# EAGLE design PicoCradle (EAGLE 9.6.2)
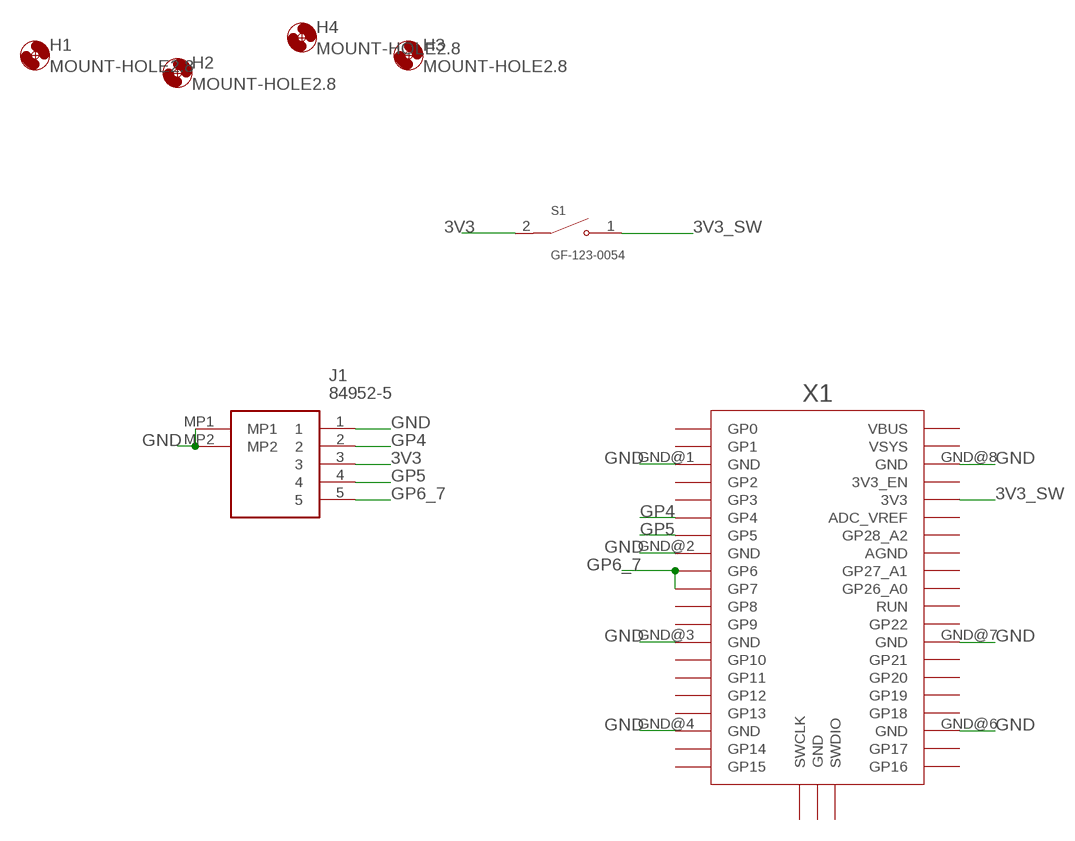
[diagram p0: schematic, sheet 1]

## Parts
H1  MOUNT-HOLE2.8  [2,8]
H2  MOUNT-HOLE2.8  [2,8]
H3  MOUNT-HOLE2.8  [2,8]
H4  MOUNT-HOLE2.8  [2,8]
J1  84952-5  [849525]
S1  GF-123-0054  [SW_GF-123-0054]
X1  RPI_PICO_IG-SMD  [RPI_PICO]

## Nets
3V3: J1.3 S1.2
3V3_SW: S1.1 X1.3V3
GND: J1.1 J1.MP1 J1.MP2 X1.GND@1(GND) X1.GND@2(GND) X1.GND@3(GND) X1.GND@4(GND) X1.GND@6(GND) X1.GND@7(GND) X1.GND@8(GND)
GP4: J1.2 X1.GP4
GP5: J1.4 X1.GP5
GP6_7: J1.5 X1.GP6 X1.GP7
Unconnected: X1.3V3_EN X1.ADC_VREF X1.AGND X1.GND@5(GND) X1.GP0 X1.GP1 X1.GP2 X1.GP3 X1.GP8 X1.GP9 X1.GP10 X1.GP11 X1.GP12 X1.GP13 X1.GP14 X1.GP15 X1.GP16 X1.GP17 X1.GP18 X1.GP19 X1.GP20 X1.GP21 X1.GP22 X1.GP26_A0 X1.GP27_A1 X1.GP28_A2 X1.RUN X1.SWCLK X1.SWDIO X1.VBUS X1.VSYS

## Library data of the parts
H1-H4 = holes:MOUNT-HOLE: MOUNTING HOLE with drill center marker
J1 = 84952-5:84952-5: 1MM FPC HORZ.BTTM CONT.ASS.5P Source: Datasheet <https://www.te.com/commerce/DocumentDelivery/DDEController?Action=srchrtrv&DocNm=84952&DocType=Customer Drawing&DocLang=English>; DESCRIPTION: 1MM FPC HORZ.BTTM CONT.ASS.5P; HEIGHT: 2.74mm; MANUFACTURER_NAME: TE Connectivity; MANUFACTURER_PART_NUMBER: 84952-5
S1 = GF-123-0054:GF-123-0054: Slide Switch SPST Through Hole Check availability <https://pricing.snapeda.com/parts/GF-123-0054/CW%20Industries/view-part?ref=eda>; AVAILABILITY: In Stock; DESCRIPTION: Slide Switch SPST Through Hole; MF: CW Industries; MP: GF-123-0054; PACKAGE: None; PRICE: None; PURCHASE-URL: https://pricing.snapeda.com/search/part/GF-123-0054/?ref=eda
X1 = RaspberryPi_Pico:RPI_PICO_IG

## Board
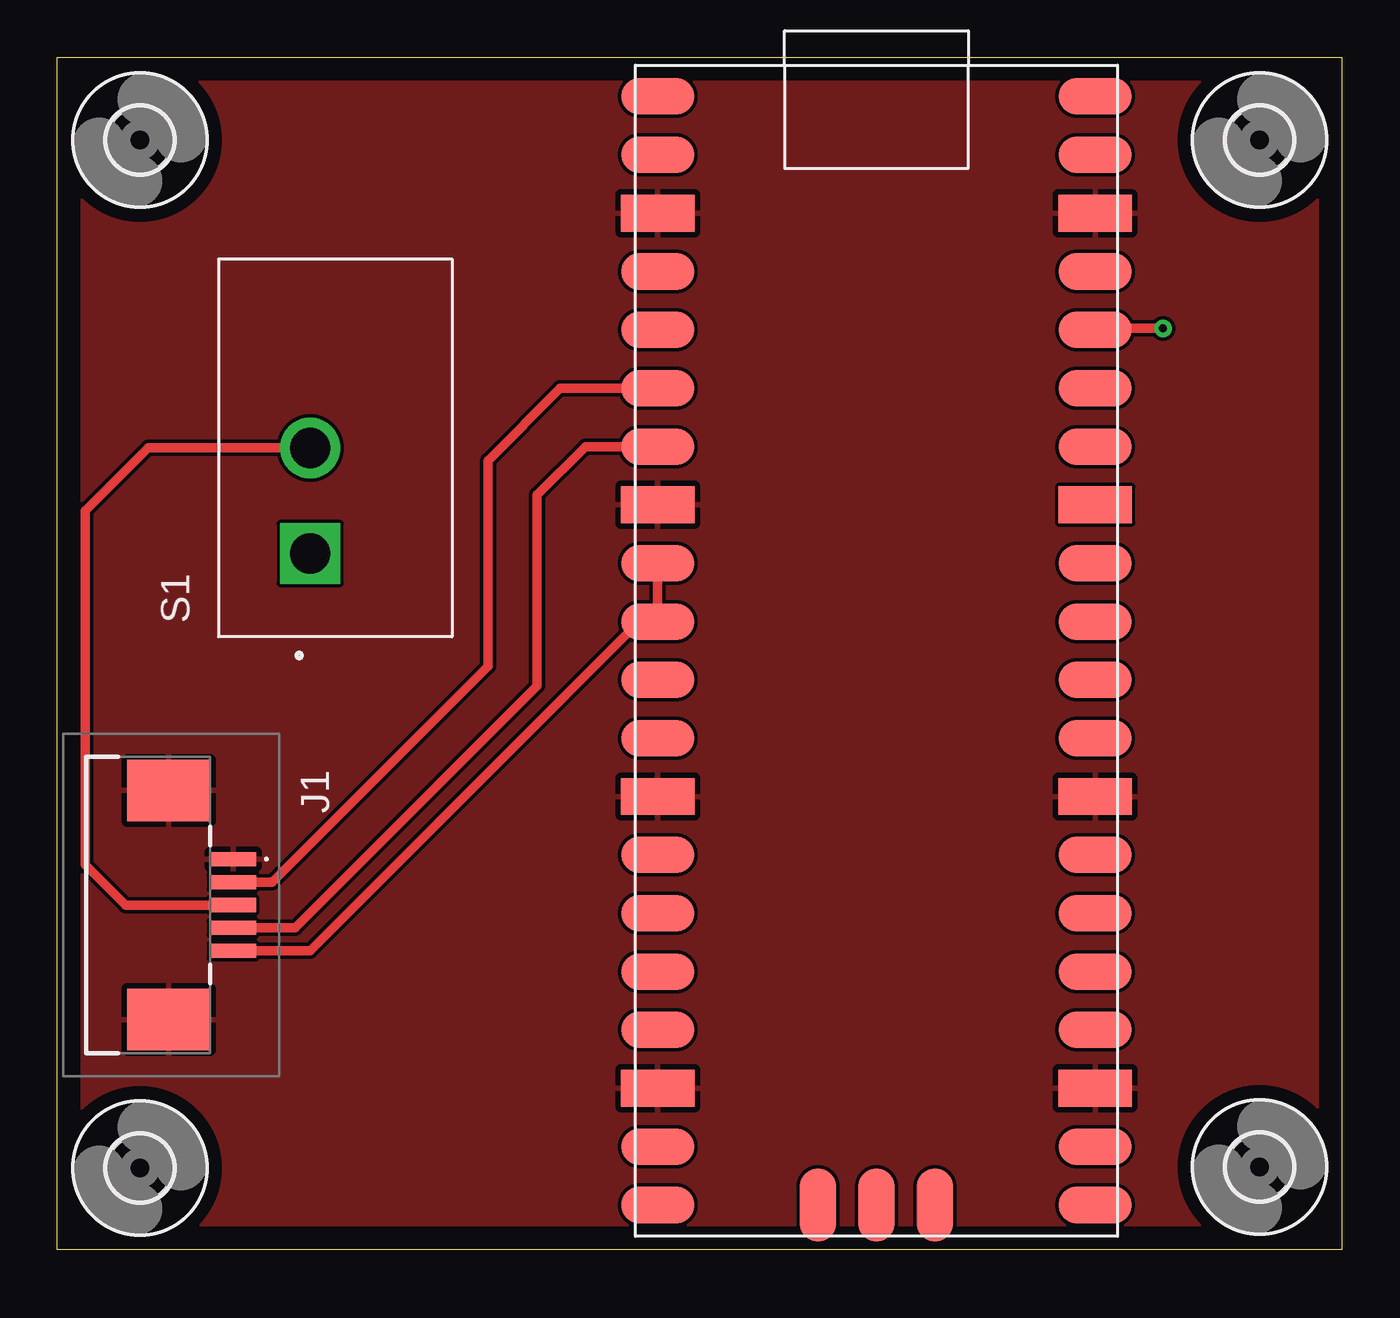
[diagram p1: board, top side]
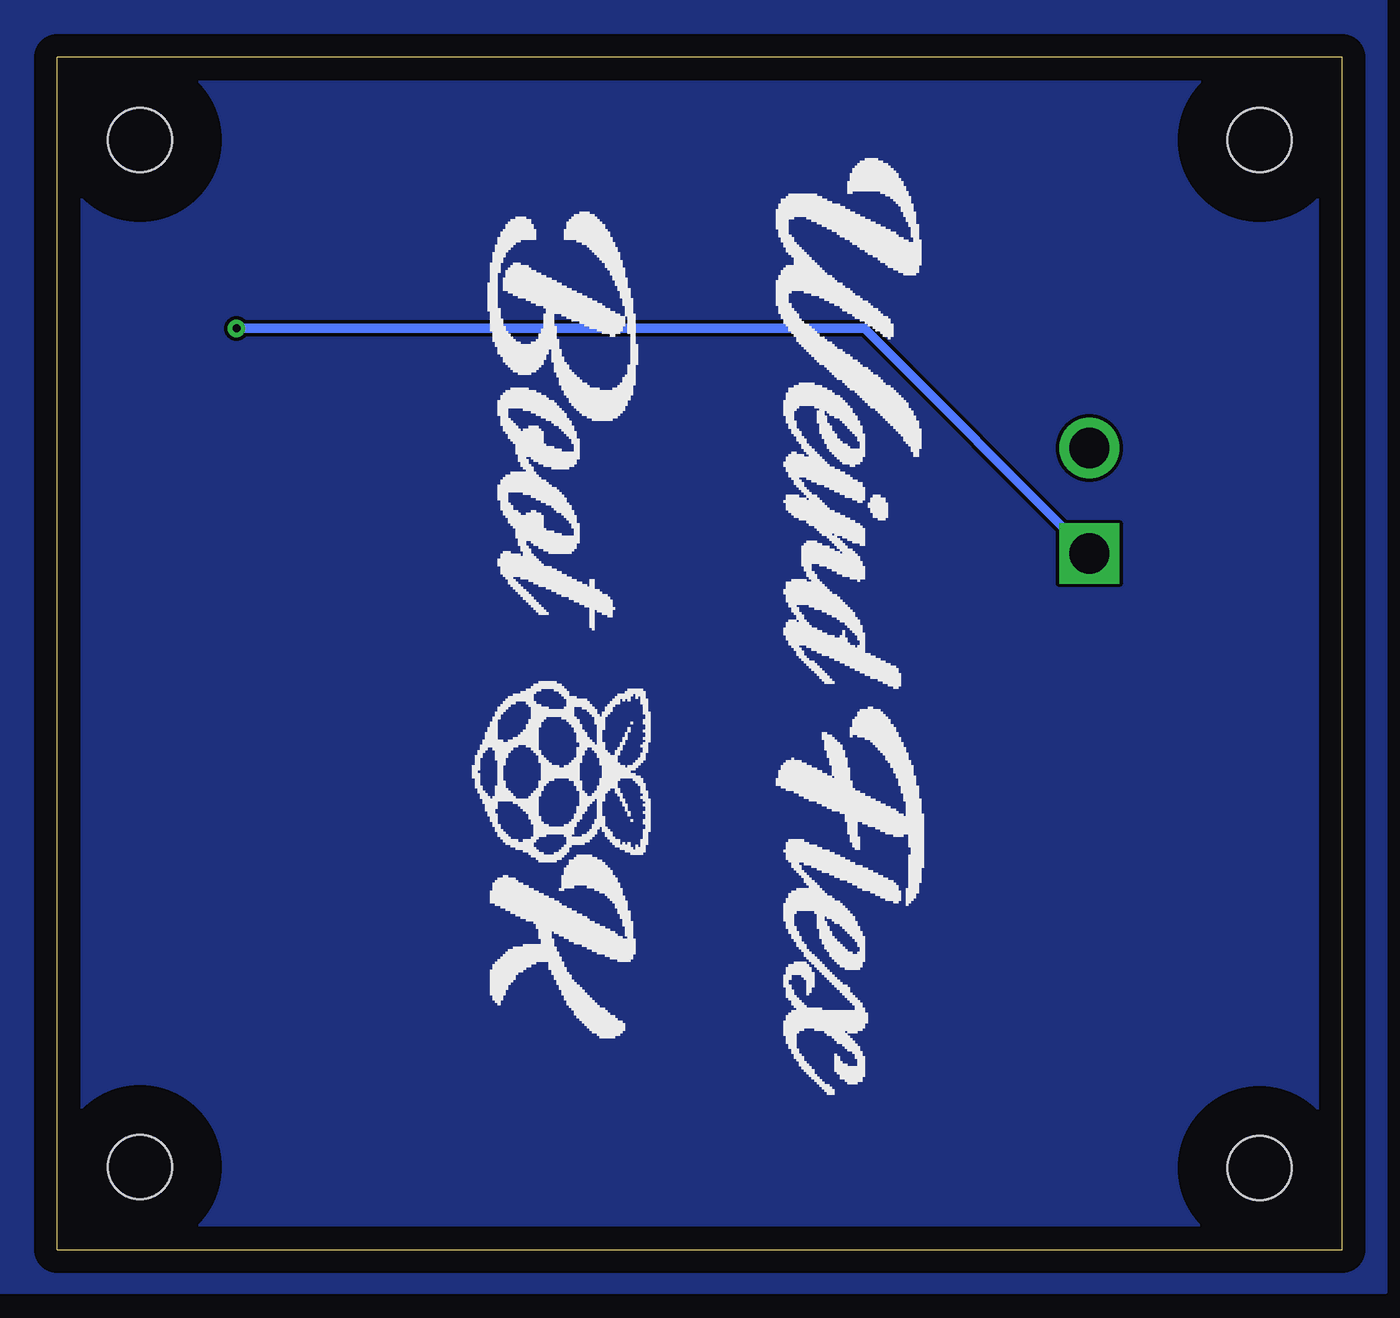
[diagram p2: board, bottom side, seen from below]

Size 55.95 x 51.9 mm. Coordinates in mm from the lower left corner, seen from the top.
Outline: 0,0 0,51.9 55.95,51.9 55.95,0 0,0
Copper layers (1*16): Top 0.035mm / dielectric 1.5mm / Bottom 0.035mm
Design rules "default *": minimum track width 6mil, minimum drill 0.35mm, track to track 6mil, track to pad 6mil, pad to pad 6mil, via to via 6mil, smd to smd 6mil, copper to edge 40mil, drill to drill 6mil, minimum pad ring 10mil, minimum via ring 8mil, stop-mask expansion 4mil, vias tented up to drill 36mil, thermal gap 10mil

### Footprints (pad centres in the part's own frame; a part is rotated, then mirrored left to right if it is on the bottom)
2,8 = hole 2.8: 0,0
849525 = smd 0.61 x 2: 1 -2,3.2; 2 -1,3.2; 3 0,3.2; 4 1,3.2; 5 2,3.2 | smd 2.68 x 3.6: MP1 -4.99,0.4; MP2 4.99,0.4
SW_GF-123-0054 = drill 1.75 square: 1 -4.6,1.09 | drill 1.75: 2 0,1.09
RPI_PICO = smd 3.2 x 1.6: 3V3 9.525,13.97; 3V3_EN 9.525,16.51; ADC_VREF 9.525,11.43; AGND 9.525,6.35; GND@1 -9.525,19.05; GND@2 -9.525,6.35; GND@3 -9.525,-6.35; GND@4 -9.525,-19.05; GND@6 9.525,-19.05; GND@7 9.525,-6.35; GND@8 9.525,19.05; GP0 -9.525,24.13; GP1 -9.525,21.59; GP2 -9.525,16.51; GP3 -9.525,13.97; GP4 -9.525,11.43; GP5 -9.525,8.89; GP6 -9.525,3.81; GP7 -9.525,1.27; GP8 -9.525,-1.27; GP9 -9.525,-3.81; GP10 -9.525,-8.89; GP11 -9.525,-11.43; GP12 -9.525,-13.97; GP13 -9.525,-16.51; GP14 -9.525,-21.59; GP15 -9.525,-24.13; GP16 9.525,-24.13; GP17 9.525,-21.59; GP18 9.525,-16.51; GP19 9.525,-13.97; GP20 9.525,-11.43; GP21 9.525,-8.89; GP22 9.525,-3.81; GP26_A0 9.525,1.27; GP27_A1 9.525,3.81; GP28_A2 9.525,8.89; RUN 9.525,-1.27; VBUS 9.525,24.13; VSYS 9.525,21.59 | smd 1.6 x 3.2: GND@5 0,-24.13; SWCLK -2.54,-24.13; SWDIO 2.54,-24.13

### Placement (x,y rotation side)
H1  3.6,3.55 0 top
H2  3.6,48.3 0 top
H3  52.35,3.6 0 top
H4  52.35,48.3 0 top
J1  4.45,15 270 top
S1  12.1,34.9 90 top
U$1  [SCREENSHOT_FROM_2022#08#13_22#09#53#PNG]  27.55,27.8 270 bottom
X1  35.67,26.07 0 top

### Tracks (layer width: path | path; a pad name or v marks a point on that pad's centre or on a via)
3V3
  Top 0.406: J1.3 2.97,15 1.22,16.75 1.22,32.17 3.95,34.9 S1.2
3V3_SW  (via drill 0.35)
  Top 0.406: v48.15,40.1 45.26,40.1 X1.3V3
  Bottom 0.406: S1.1 20.81,40.1 v48.15,40.1
GND
  pour Top: -2.5,55.15 60.25,55.15 60.25,19.05 60.25,-4.15 6.1,-4.15 -2.5,-4.15
  pour Bottom: -1.9,54.85 58.9,54.85 58.9,38.95 58.9,-1.85 29.6,-1.85 -1.9,-1.85
GP4
  Top 0.406: J1.2 9.35,16 18.75,25.4 18.75,34.35 21.9,37.5 X1.GP4
GP5
  Top 0.406: J1.4 10.35,14 20.9,24.55 20.9,32.85 23.01,34.96 X1.GP5
GP6_7
  Top 0.406: J1.5 11,13 25.34,27.34 X1.GP7 X1.GP6